# Altium schematic sheet MOSFETs and Driver.SchDoc
size B
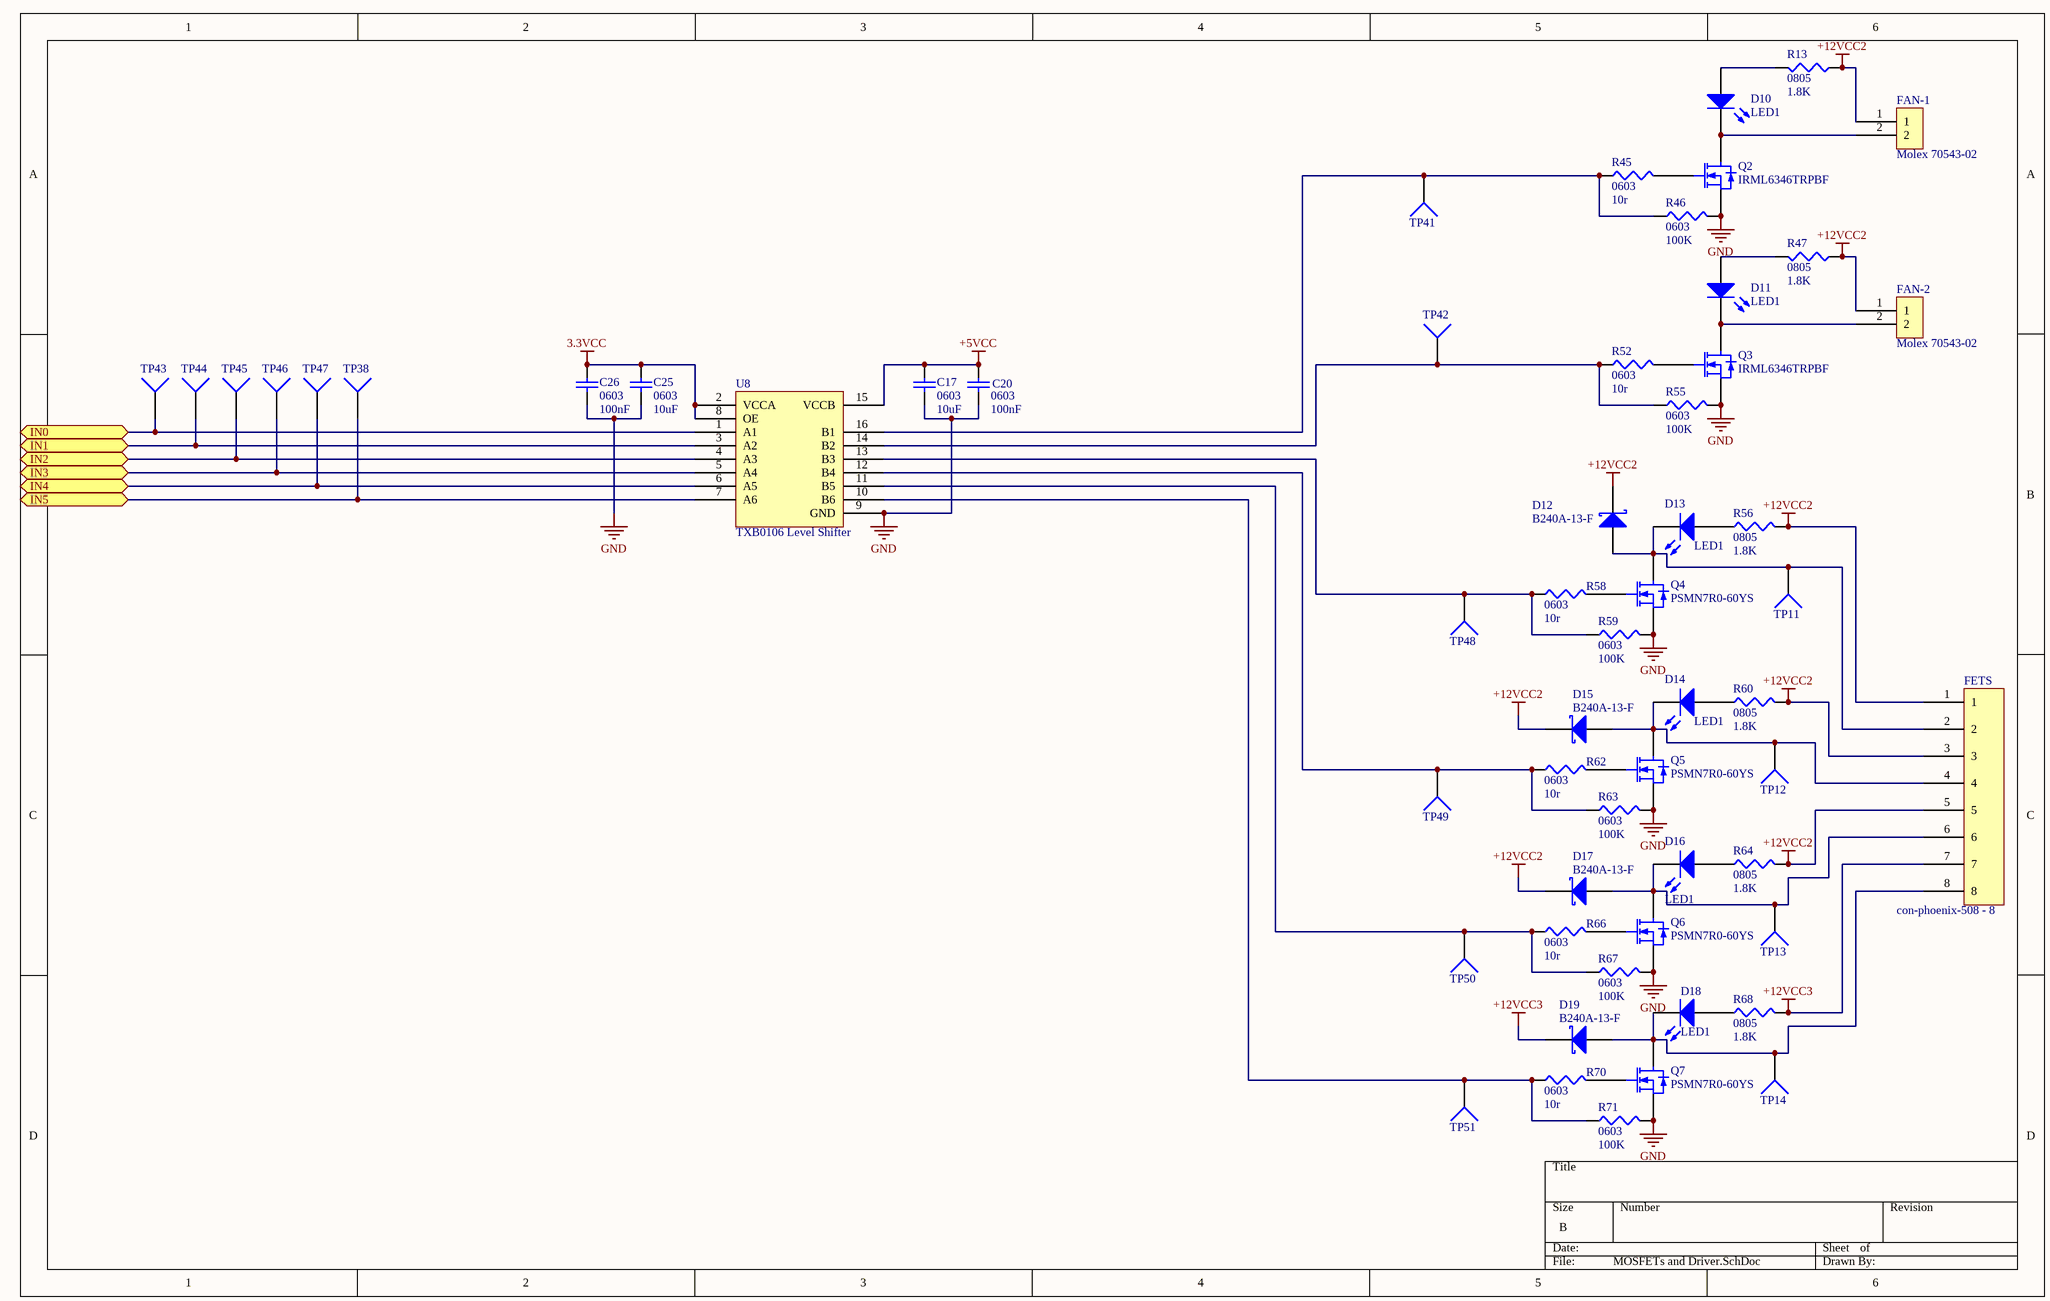
[diagram p0: MOSFETs and Driver.SchDoc]

## Parts
C17  0603  value 10uF  [1608[0603]]
C20  0603  value 100nF  [1608[0603]]
C25  0603  value 10uF  [1608[0603]]
C26  0603  value 100nF  [1608[0603]]
D10  LED1  [SM 0805 polarized]
D11  LED1  [SM 0805 polarized]
D12  B240A-13-F  [SK310A-TP]
D13  LED1  [SM 0805 polarized]
D14  LED1  [SM 0805 polarized]
D15  B240A-13-F  [SK310A-TP]
D16  LED1  [SM 0805 polarized]
D17  B240A-13-F  [SK310A-TP]
D18  LED1  [SM 0805 polarized]
D19  B240A-13-F  [SK310A-TP]
FAN-1  Molex 70543-02  [70543-02]
FAN-2  Molex 70543-02  [70543-02]
FETS  con-phoenix-508 - 8  [MSTBV4]
Q2  IRML6346TRPBF  [IRLML6346]
Q3  IRML6346TRPBF  [IRLML6346]
Q4  PSMN7R0-60YS  [PSMN7R0-60YS]
Q5  PSMN7R0-60YS  [PSMN7R0-60YS]
Q6  PSMN7R0-60YS  [PSMN7R0-60YS]
Q7  PSMN7R0-60YS  [PSMN7R0-60YS]
R13  0805  value 1.8K  [SM 0805 - gap trimmed]
R45  0603  value 10r  [J1-0603]
R46  0603  value 100K  [J1-0603]
R47  0805  value 1.8K  [SM 0805 - gap trimmed]
R52  0603  value 10r  [J1-0603]
R55  0603  value 100K  [J1-0603]
R56  0805  value 1.8K  [SM 0805 - gap trimmed]
R58  0603  value 10r  [J1-0603]
R59  0603  value 100K  [J1-0603]
R60  0805  value 1.8K  [SM 0805 - gap trimmed]
R62  0603  value 10r  [J1-0603]
R63  0603  value 100K  [J1-0603]
R64  0805  value 1.8K  [SM 0805 - gap trimmed]
R66  0603  value 10r  [J1-0603]
R67  0603  value 100K  [J1-0603]
R68  0805  value 1.8K  [SM 0805 - gap trimmed]
R70  0603  value 10r  [J1-0603]
R71  0603  value 100K  [J1-0603]
TP11  TP4  [TP-2]  (value not drawn)
TP12  TP4  [TP-2]  (value not drawn)
TP13  TP4  [TP-2]  (value not drawn)
TP14  TP4  [TP-2]  (value not drawn)
TP38  TP4  [TP-2]  (value not drawn)
TP41  TP4  [TP-2]  (value not drawn)
TP42  TP4  [TP-2]  (value not drawn)
TP43  TP4  [TP-2]  (value not drawn)
TP44  TP4  [TP-2]  (value not drawn)
TP45  TP4  [TP-2]  (value not drawn)
TP46  TP4  [TP-2]  (value not drawn)
TP47  TP4  [TP-2]  (value not drawn)
TP48  TP4  [TP-2]  (value not drawn)
TP49  TP4  [TP-2]  (value not drawn)
TP50  TP4  [TP-2]  (value not drawn)
TP51  TP4  [TP-2]  (value not drawn)
U8  TXB0106 Level Shifter  [TSOP65P640X120-16N]

## Ports
IN0, IN1, IN2, IN3, IN4, IN5

## Nets
3.3VCC: C25.2 C26.1 U8.2(VCCA) U8.8(OE)
+5VCC: C17.1 C20.1 U8.15(VCCB)
+12VCC2: D12.2(K) D15.2(K) D17.2(K) FAN-1.1 FAN-2.1 FETS.1 FETS.3 FETS.5 R13.1 R47.1 R56.2 R60.2 R64.2
+12VCC3: D19.2(K) FETS.7 R68.2
GND: C17.2 C20.2 C25.1 C26.2 Q2.2(S) Q3.2(S) Q4.1(S) Q4.2(S) Q4.3(S) Q5.1(S) Q5.2(S) Q5.3(S) Q6.1(S) Q6.2(S) Q6.3(S) Q7.1(S) Q7.2(S) Q7.3(S) R46.2 R55.2 R59.2 R63.2 R67.2 R71.2 U8.9(GND)
IN0: TP43.1 U8.1(A1) ; port IN0
IN1: TP44.1 U8.3(A2) ; port IN1
IN2: TP45.1 U8.4(A3) ; port IN2
IN3: TP46.1 U8.5(A4) ; port IN3
IN4: TP47.1 U8.6(A5) ; port IN4
IN5: TP38.1 U8.7(A6) ; port IN5
NetD10_1: D10.1(A) FAN-1.2 Q2.3(D)
NetD10_2: D10.2(K) R13.2
NetD11_1: D11.1(A) FAN-2.2 Q3.3(D)
NetD11_2: D11.2(K) R47.2
NetD12_1: D12.1(A) D13.1(A) FETS.2 Q4.5(D) TP11.1
NetD13_2: D13.2(K) R56.1
NetD14_1: D14.1(A) D15.1(A) FETS.4 Q5.5(D) TP12.1
NetD14_2: D14.2(K) R60.1
NetD16_1: D16.1(A) D17.1(A) FETS.6 Q6.5(D) TP13.1
NetD16_2: D16.2(K) R64.1
NetD18_1: D18.1(A) D19.1(A) FETS.8 Q7.5(D) TP14.1
NetD18_2: D18.2(K) R68.1
NetQ2_1: Q2.1(G) R45.2
NetQ3_1: Q3.1(G) R52.2
NetQ4_4: Q4.4(G) R58.2
NetQ5_4: Q5.4(G) R62.2
NetQ6_4: Q6.4(G) R66.2
NetQ7_4: Q7.4(G) R70.2
NetR45_1: R45.1 R46.1 TP41.1 U8.16(B1)
NetR52_1: R52.1 R55.1 TP42.1 U8.14(B2)
NetR58_1: R58.1 R59.1 TP48.1 U8.13(B3)
NetR62_1: R62.1 R63.1 TP49.1 U8.12(B4)
NetR66_1: R66.1 R67.1 TP50.1 U8.11(B5)
NetR70_1: R70.1 R71.1 TP51.1 U8.10(B6)

## Library data of the parts
C17 C20 C25 C26 = Cap Semi: Capacitor (Semiconductor SIM Model); Published: 8-Jun-2000; LatestRevisionDate: 29-May-2009; LatestRevisionNote: IPC-7351 Footprint Added.; PackageReference: C1206; Publisher: Altium Limited; PackageDescription: Chip Capacitor
D10 D11 D13 D14 D16 D18 = LED1: Typical RED GaAs LED; Published: 8-Jun-2000; LatestRevisionDate: 08-Jul-2005; LatestRevisionNote: Mech Layer 1 removed.; PackageReference: LED-1; Publisher: Altium Limited; PackageDescription: LED; 2 Leads
D12 D15 D17 D19 = D Schottky: Schottky Diode; Published: 8-Jun-2000; LatestRevisionDate: 17-Jul-2002; LatestRevisionNote: Re-released for DXP Platform.; PackageReference: SMB; Publisher: Altium Limited; PackageDescription: DO-214-AA/SMB; 2 C-Bend Leads; Body 5.3 x 3.6 mm, inc. leads (LxW); Code_JEDEC: DO-214-AA
FETS = con-phoenix-508
Q2 Q3 = IRML6346TRPBF: N-Channel MOSFET; Published: 8-Jun-2000; LatestRevisionDate: 17-Jul-2002; LatestRevisionNote: Re-released for DXP Platform.; PackageVersion: 1995/1996; PackageReference: E3; Publisher: Altium Limited; PackageDescription: TO, Flat Index; 3 In-Line, Axial Leads; Body Dia. 4.6mm; Lead Dia. 0.5 mm (max)
Q4-Q7 = PSMN7R0-60YS: N-Channel MOSFET; Published: 8-Jun-2000; LatestRevisionDate: 17-Jul-2002; LatestRevisionNote: Re-released for DXP Platform.; PackageVersion: 1995/1996; PackageReference: E3; Publisher: Altium Limited; PackageDescription: TO, Flat Index; 3 In-Line, Axial Leads; Body Dia. 4.6mm; Lead Dia. 0.5 mm (max)
R13 R45-R47 R52 R55 R56 R58-R60 R62-R64 R66-R68 R70 R71 = Res3: Resistor; Published: 8-Jun-2000; LatestRevisionDate: 29-May-2009; LatestRevisionNote: IPC-7351 Footprint Added.; PackageReference: J1-0603; Publisher: Altium Limited; PackageDescription: Chip Resistor
TP11-TP14 TP38 TP41-TP51 = Socket: LatestRevisionDate: 17-Jul-2002; LatestRevisionNote: Re-released for DXP Platform.; Publisher: Altium Limited
U8 = TXB0106: TXB0106 - Bidriectional Opendrain/pushpull level shift